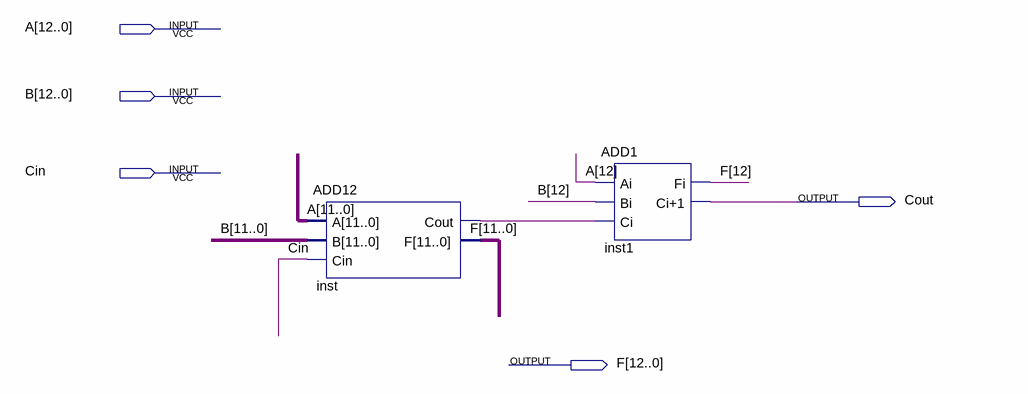
[diagram p0: schematic sheet]
// Quartus schematic ADD13.bdf as structural Verilog: 2 symbols, 5 pins
module ADD13 (
  input  [12:0] A,
  input  [12:0] B,
  input  Cin,
  output Cout,
  output [12:0] F
);

  wire inst_cout;

  ADD12 inst (.A(A[11:0]), .B(B[11:0]), .Cin(Cin), .Cout(inst_cout), .F(F[11:0]));
  ADD1 inst1 (.Ai(A[12]), .Bi(B[12]), .Ci(inst_cout), .Fi(F[12]), .\Ci+1 (Cout));
endmodule
